# EAGLE design PGTNX08_pitch_out (EAGLE 8.5.2)
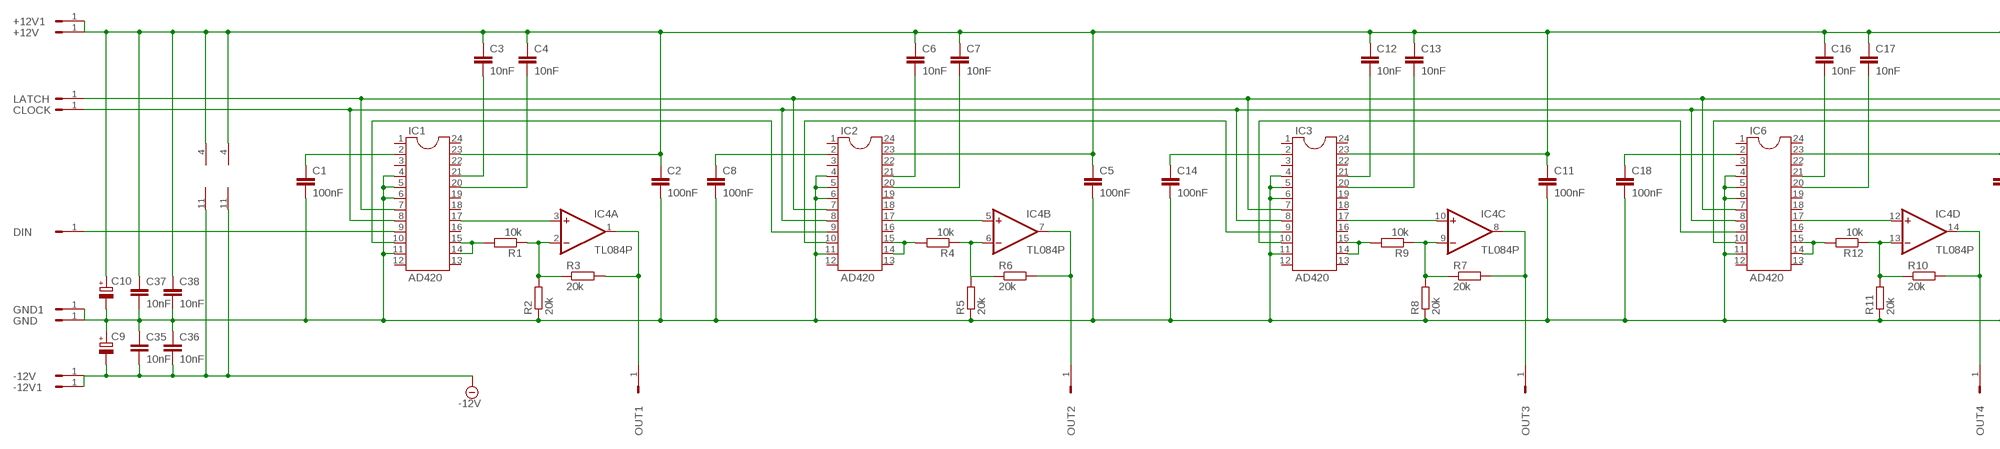
[diagram p0: schematic, sheet 1, part 1 of 2]
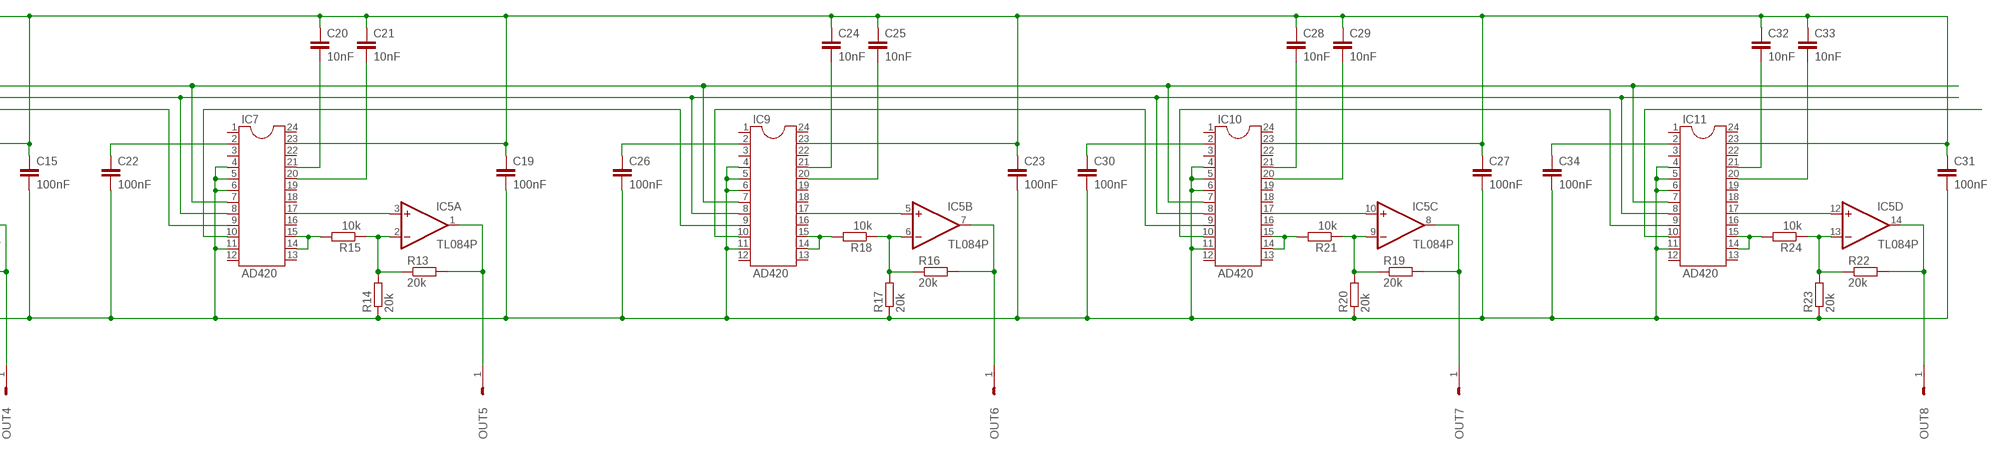
[diagram p1: schematic, sheet 1, part 2 of 2]

## Parts
+12V  HEADER/MALE/01  [HEADER/MALE/01]
+12V1  HEADER/MALE/01  [HEADER/MALE/01]
-12V  HEADER/MALE/01  [HEADER/MALE/01]
-12V1  HEADER/MALE/01  [HEADER/MALE/01]
C1  100nF  CAPACITORCERAMICDISC/5  [CERAMICDISC/5]
C2  100nF  CAPACITORCERAMICDISC/5  [CERAMICDISC/5]
C3  10nF  CAPACITORCERAMICDISC/5  [CERAMICDISC/5]
C4  10nF  CAPACITORCERAMICDISC/5  [CERAMICDISC/5]
C5  100nF  CAPACITORCERAMICDISC/5  [CERAMICDISC/5]
C6  10nF  CAPACITORCERAMICDISC/5  [CERAMICDISC/5]
C7  10nF  CAPACITORCERAMICDISC/5  [CERAMICDISC/5]
C8  100nF  CAPACITORCERAMICDISC/5  [CERAMICDISC/5]
C9  CAPACITOR/POLARIZEDE2.5-6  [E2,5-6]
C10  CAPACITOR/POLARIZEDE2.5-6  [E2,5-6]
C11  100nF  CAPACITORCERAMICDISC/5  [CERAMICDISC/5]
C12  10nF  CAPACITORCERAMICDISC/5  [CERAMICDISC/5]
C13  10nF  CAPACITORCERAMICDISC/5  [CERAMICDISC/5]
C14  100nF  CAPACITORCERAMICDISC/5  [CERAMICDISC/5]
C15  100nF  CAPACITORCERAMICDISC/5  [CERAMICDISC/5]
C16  10nF  CAPACITORCERAMICDISC/5  [CERAMICDISC/5]
C17  10nF  CAPACITORCERAMICDISC/5  [CERAMICDISC/5]
C18  100nF  CAPACITORCERAMICDISC/5  [CERAMICDISC/5]
C19  100nF  CAPACITORCERAMICDISC/5  [CERAMICDISC/5]
C20  10nF  CAPACITORCERAMICDISC/5  [CERAMICDISC/5]
C21  10nF  CAPACITORCERAMICDISC/5  [CERAMICDISC/5]
C22  100nF  CAPACITORCERAMICDISC/5  [CERAMICDISC/5]
C23  100nF  CAPACITORCERAMICDISC/5  [CERAMICDISC/5]
C24  10nF  CAPACITORCERAMICDISC/5  [CERAMICDISC/5]
C25  10nF  CAPACITORCERAMICDISC/5  [CERAMICDISC/5]
C26  100nF  CAPACITORCERAMICDISC/5  [CERAMICDISC/5]
C27  100nF  CAPACITORCERAMICDISC/5  [CERAMICDISC/5]
C28  10nF  CAPACITORCERAMICDISC/5  [CERAMICDISC/5]
C29  10nF  CAPACITORCERAMICDISC/5  [CERAMICDISC/5]
C30  100nF  CAPACITORCERAMICDISC/5  [CERAMICDISC/5]
C31  100nF  CAPACITORCERAMICDISC/5  [CERAMICDISC/5]
C32  10nF  CAPACITORCERAMICDISC/5  [CERAMICDISC/5]
C33  10nF  CAPACITORCERAMICDISC/5  [CERAMICDISC/5]
C34  100nF  CAPACITORCERAMICDISC/5  [CERAMICDISC/5]
C35  10nF  CAPACITORCERAMICDISC/5  [CERAMICDISC/5]
C36  10nF  CAPACITORCERAMICDISC/5  [CERAMICDISC/5]
C37  10nF  CAPACITORCERAMICDISC/5  [CERAMICDISC/5]
C38  10nF  CAPACITORCERAMICDISC/5  [CERAMICDISC/5]
CLOCK  HEADER/MALE/01  [HEADER/MALE/01]
DIN  HEADER/MALE/01  [HEADER/MALE/01]
GND  HEADER/MALE/01  [HEADER/MALE/01]
GND1  HEADER/MALE/01  [HEADER/MALE/01]
IC1  AD420  DIL24-3  [DIL24-3]
IC2  AD420  DIL24-3  [DIL24-3]
IC3  AD420  DIL24-3  [DIL24-3]
IC4  TL084P  [DIL14]
IC5  TL084P  [DIL14]
IC6  AD420  DIL24-3  [DIL24-3]
IC7  AD420  DIL24-3  [DIL24-3]
IC9  AD420  DIL24-3  [DIL24-3]
IC10  AD420  DIL24-3  [DIL24-3]
IC11  AD420  DIL24-3  [DIL24-3]
LATCH  HEADER/MALE/01  [HEADER/MALE/01]
OUT1  HEADER/MALE/01  [HEADER/MALE/01]
OUT2  HEADER/MALE/01  [HEADER/MALE/01]
OUT3  HEADER/MALE/01  [HEADER/MALE/01]
OUT4  HEADER/MALE/01  [HEADER/MALE/01]
OUT5  HEADER/MALE/01  [HEADER/MALE/01]
OUT6  HEADER/MALE/01  [HEADER/MALE/01]
OUT7  HEADER/MALE/01  [HEADER/MALE/01]
OUT8  HEADER/MALE/01  [HEADER/MALE/01]
R1  10k  R-EU_0204/7  [0204/7]
R2  20k  R-EU_0204/7  [0204/7]
R3  20k  RESISTORRESISTOR/UPRIGHT/7.5  [RESISTOR/7.5]
R4  10k  R-EU_0204/7  [0204/7]
R5  20k  R-EU_0204/7  [0204/7]
R6  20k  RESISTORRESISTOR/UPRIGHT/7.5  [RESISTOR/7.5]
R7  20k  RESISTORRESISTOR/UPRIGHT/7.5  [RESISTOR/7.5]
R8  20k  RESISTORRESISTOR/UPRIGHT/7.5  [RESISTOR/7.5]
R9  10k  RESISTORRESISTOR/UPRIGHT/7.5  [RESISTOR/7.5]
R10  20k  RESISTORRESISTOR/UPRIGHT/7.5  [RESISTOR/7.5]
R11  20k  RESISTORRESISTOR/UPRIGHT/7.5  [RESISTOR/7.5]
R12  10k  RESISTORRESISTOR/UPRIGHT/7.5  [RESISTOR/7.5]
R13  20k  RESISTORRESISTOR/UPRIGHT/7.5  [RESISTOR/7.5]
R14  20k  RESISTORRESISTOR/UPRIGHT/7.5  [RESISTOR/7.5]
R15  10k  RESISTORRESISTOR/UPRIGHT/7.5  [RESISTOR/7.5]
R16  20k  RESISTORRESISTOR/UPRIGHT/7.5  [RESISTOR/7.5]
R17  20k  RESISTORRESISTOR/UPRIGHT/7.5  [RESISTOR/7.5]
R18  10k  RESISTORRESISTOR/UPRIGHT/7.5  [RESISTOR/7.5]
R19  20k  RESISTORRESISTOR/UPRIGHT/7.5  [RESISTOR/7.5]
R20  20k  RESISTORRESISTOR/UPRIGHT/7.5  [RESISTOR/7.5]
R21  10k  RESISTORRESISTOR/UPRIGHT/7.5  [RESISTOR/7.5]
R22  20k  RESISTORRESISTOR/UPRIGHT/7.5  [RESISTOR/7.5]
R23  20k  RESISTORRESISTOR/UPRIGHT/7.5  [RESISTOR/7.5]
R24  10k  RESISTORRESISTOR/UPRIGHT/7.5  [RESISTOR/7.5]

## Nets
+12V: +12V1.1 +12V.1 C2.1 C3.1 C4.1 C5.1 C6.1 C7.1 C10.+ C11.1 C12.1 C13.1 C15.1 C16.1 C17.1 C19.1 C20.1 C21.1 C23.1 C24.1 C25.1 C27.1 C28.1 C29.1 C31.1 C32.1 C33.1 C37.1 C38.1 IC1.23 IC2.23 IC3.23 IC4.4(P:V+) IC5.4(P:V+) IC6.23 IC7.23 IC9.23 IC10.23 IC11.23
-12V: -12V1.1 -12V.1 C9.- C35.2 C36.2 IC4.11(P:V-) IC5.11(P:V-)
GND: C1.2 C2.2 C5.2 C8.2 C9.+ C10.- C11.2 C14.2 C15.2 C18.2 C19.2 C22.2 C23.2 C26.2 C27.2 C30.2 C31.2 C34.2 C35.1 C36.1 C37.2 C38.2 GND1.1 GND.1 IC1.4 IC1.5 IC1.6 IC1.11 IC2.4 IC2.5 IC2.6 IC2.11 IC3.4 IC3.5 IC3.6 IC3.11 IC6.4 IC6.5 IC6.6 IC6.11 IC7.4 IC7.5 IC7.6 IC7.11 IC9.4 IC9.5 IC9.6 IC9.11 IC10.4 IC10.5 IC10.6 IC10.11 IC11.4 IC11.5 IC11.6 IC11.11 R2.1 R5.1 R8.1 R11.1 R14.1 R17.1 R20.1 R23.1
N$1: IC3.10 IC6.9
N$2: IC6.10 IC7.9
N$3: DIN.1 IC1.9
N$4: IC2.14 IC2.15 R4.2
N$5: IC2.10 IC3.9
N$6: IC4.2(A:-IN) R1.1 R2.2 R3.1
N$7: IC9.10 IC10.9
N$8: C1.1 IC1.2
N$9: C3.2 IC1.21
N$10: C4.2 IC1.20
N$11: IC1.17 IC4.3(A:+IN)
N$12: IC1.14 IC1.15 R1.2
N$13: IC4.1(A:OUT) OUT1.1 R3.2
N$14: IC7.10 IC9.9
N$15: IC1.10 IC2.9
N$16: IC2.17 IC4.5(B:+IN)
N$17: IC4.7(B:OUT) OUT2.1 R6.2
N$18: IC3.14 IC3.15 R9.2
N$19: C8.1 IC2.2
N$20: C6.2 IC2.21
N$21: C7.2 IC2.20
N$22: IC4.6(B:-IN) R4.1 R5.2 R6.1
N$23: IC3.17 IC4.10(C:+IN)
N$24: IC4.8(C:OUT) OUT3.1 R7.2
N$25: C14.1 IC3.2
N$26: C12.2 IC3.21
N$27: C13.2 IC3.20
N$29: IC10.10 IC11.9
N$30: IC4.9(C:-IN) R7.1 R8.2 R9.1
N$31: IC6.14 IC6.15 R12.2
N$32: IC4.12(D:+IN) IC6.17
N$33: IC4.14(D:OUT) OUT4.1 R10.2
N$34: C18.1 IC6.2
N$35: C16.2 IC6.21
N$36: C17.2 IC6.20
N$37: CLOCK.1 IC1.8 IC2.8 IC3.8 IC6.8 IC7.8 IC9.8 IC10.8 IC11.8
N$38: IC4.13(D:-IN) R10.1 R11.2 R12.1
N$39: IC7.14 IC7.15 R15.2
N$40: IC5.3(A:+IN) IC7.17
N$41: IC5.1(A:OUT) OUT5.1 R13.2
N$42: C22.1 IC7.2
N$43: C20.2 IC7.21
N$44: C21.2 IC7.20
N$46: IC5.2(A:-IN) R13.1 R14.2 R15.1
N$47: IC9.14 IC9.15 R18.2
N$48: IC5.5(B:+IN) IC9.17
N$49: IC5.7(B:OUT) OUT6.1 R16.2
N$50: C26.1 IC9.2
N$51: C24.2 IC9.21
N$52: C25.2 IC9.20
N$53: IC11.10
N$54: IC5.6(B:-IN) R16.1 R17.2 R18.1
N$55: IC10.14 IC10.15 R21.2
N$56: IC5.10(C:+IN) IC10.17
N$57: IC5.8(C:OUT) OUT7.1 R19.2
N$58: C30.1 IC10.2
N$59: C28.2 IC10.21
N$60: C29.2 IC10.20
N$62: IC5.9(C:-IN) R19.1 R20.2 R21.1
N$63: IC11.14 IC11.15 R24.2
N$64: IC5.12(D:+IN) IC11.17
N$65: IC5.14(D:OUT) OUT8.1 R22.2
N$66: C34.1 IC11.2
N$67: C32.2 IC11.21
N$68: C33.2 IC11.20
N$69: IC1.7 IC2.7 IC3.7 IC6.7 IC7.7 IC9.7 IC10.7 IC11.7 LATCH.1
N$70: IC5.13(D:-IN) R22.1 R23.2 R24.1
Unconnected: IC1.1 IC1.3 IC1.12 IC1.13 IC1.16 IC1.18 IC1.19 IC1.22 IC1.24 IC2.1 IC2.3 IC2.12 IC2.13 IC2.16 IC2.18 IC2.19 IC2.22 IC2.24 IC3.1 IC3.3 IC3.12 IC3.13 IC3.16 IC3.18 IC3.19 IC3.22 IC3.24 IC6.1 IC6.3 IC6.12 IC6.13 IC6.16 IC6.18 IC6.19 IC6.22 IC6.24 IC7.1 IC7.3 IC7.12 IC7.13 IC7.16 IC7.18 IC7.19 IC7.22 IC7.24 IC9.1 IC9.3 IC9.12 IC9.13 IC9.16 IC9.18 IC9.19 IC9.22 IC9.24 IC10.1 IC10.3 IC10.12 IC10.13 IC10.16 IC10.18 IC10.19 IC10.22 IC10.24 IC11.1 IC11.3 IC11.12 IC11.13 IC11.16 IC11.18 IC11.19 IC11.22 IC11.24

## Library data of the parts
+12V +12V1 -12V -12V1 CLOCK DIN GND GND1 LATCH OUT1-OUT8 = connectors:HEADER/MALE/01
C1-C8 C11-C38 = capacitors:CAPACITOR: CAPACITOR, European symbol
C9 C10 = capacitors:CAPACITOR/POLARIZED: POLARIZED CAPACITOR, European symbol
IC1-IC3 IC6 IC7 IC9-IC11 = ic-package:DIL24: Dual In Line
IC4 IC5 = ic_analogue:TL084: OP AMP
R1 R2 R4 R5 = rcl:R-EU_: RESISTOR, European symbol
R3 R6-R24 = resistors:RESISTOR: RESISTOR, European symbol

## Board
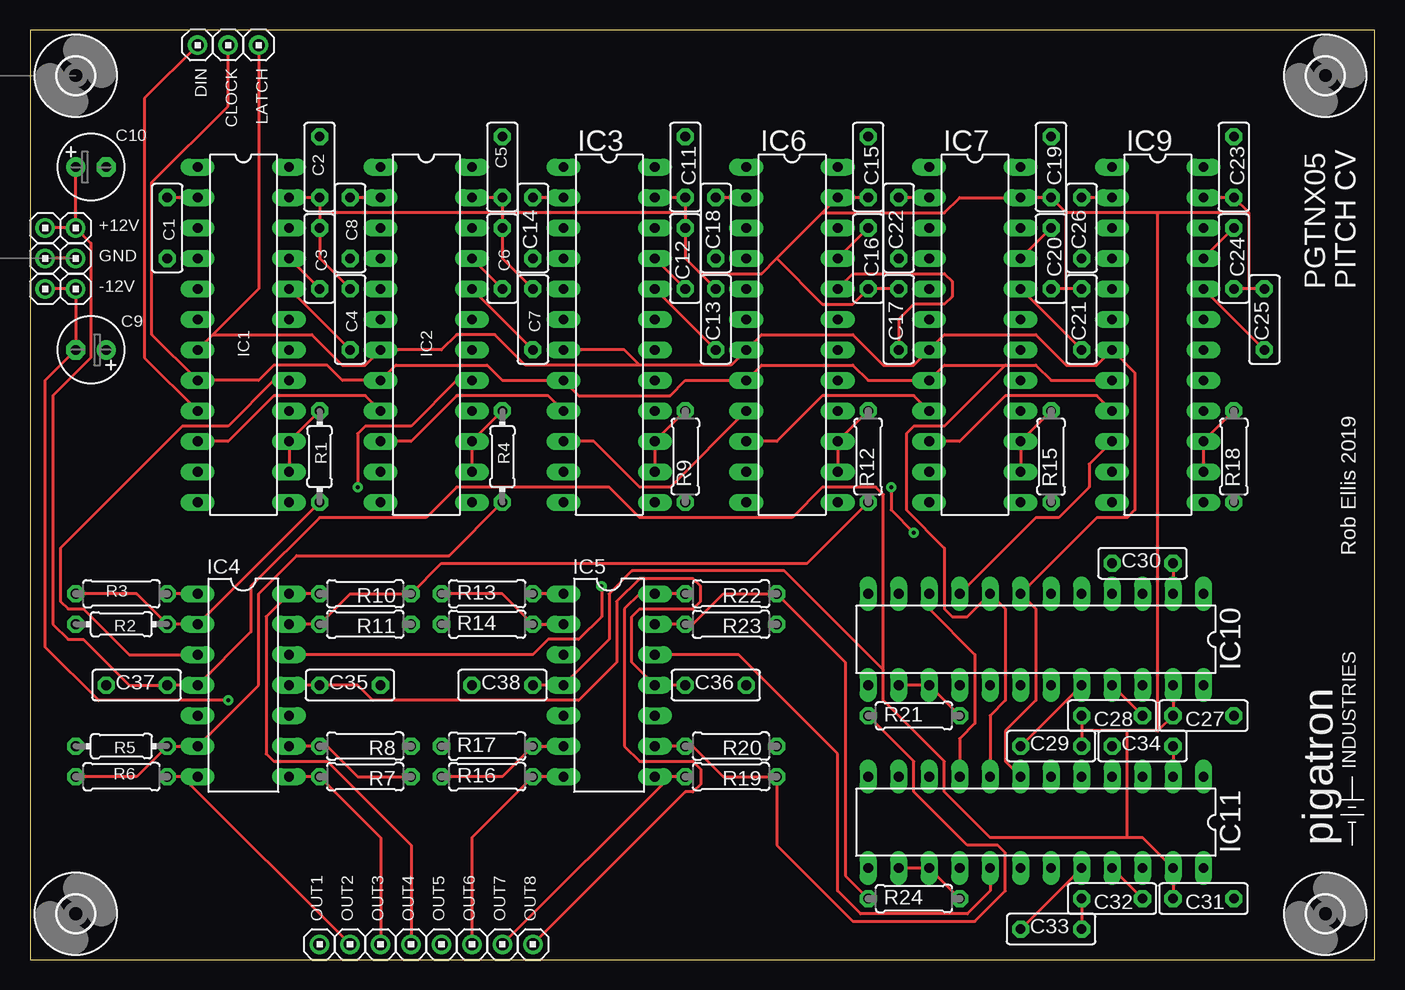
[diagram p2: board, top side]
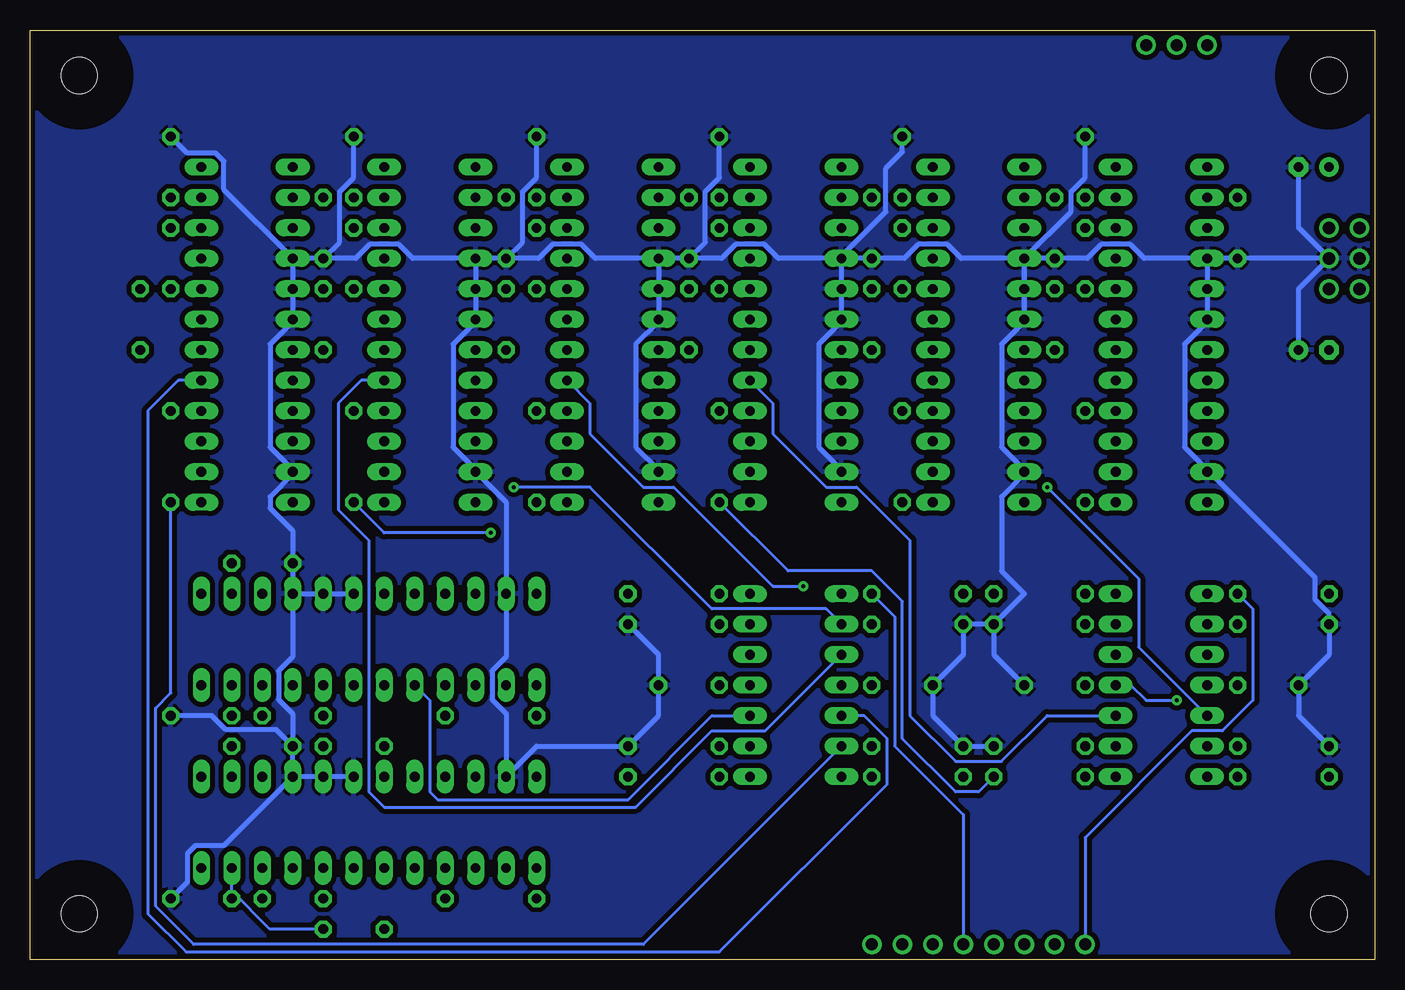
[diagram p3: board, bottom side, seen from below]

Size 112.06 x 77.46 mm. Coordinates in mm from the lower left corner, seen from the top.
Outline: 0,0 112.06,0 112.06,77.46 0,77.46 0,0
Copper layers (1*16): Top 0.0356mm / dielectric 1.5011mm / Bottom 0.0356mm
Design rules "rob": minimum track width 10mil, minimum drill 13mil, track to track 10mil, track to pad 10mil, pad to pad 10mil, via to via 10mil, smd to smd 6mil, copper to edge 15mil, drill to drill 10mil, minimum pad ring 12mil, minimum via ring 10mil, stop-mask expansion 4mil, vias tented up to drill 0mil, thermal gap 10mil

### Footprints (pad centres in the part's own frame; a part is rotated, then mirrored left to right if it is on the bottom)
HEADER/MALE/01 = drill 1.016: 1 0,0
CERAMICDISC/5 = drill 0.813 octagon: 1 -2.54,0; 2 2.54,0
E2,5-6 = drill 0.813 pad 1.6: + -1.27,0 | drill 0.813 pad 1.6 octagon: - 1.27,0
DIL24-3 = drill 0.813 long: 1 -13.97,-3.81; 2 -11.43,-3.81; 3 -8.89,-3.81; 4 -6.35,-3.81; 5 -3.81,-3.81; 6 -1.27,-3.81; 7 1.27,-3.81; 8 3.81,-3.81; 9 6.35,-3.81; 10 8.89,-3.81; 11 11.43,-3.81; 12 13.97,-3.81; 13 13.97,3.81; 14 11.43,3.81; 15 8.89,3.81; 16 6.35,3.81; 17 3.81,3.81; 18 1.27,3.81; 19 -1.27,3.81; 20 -3.81,3.81; 21 -6.35,3.81; 22 -8.89,3.81; 23 -11.43,3.81; 24 -13.97,3.81
DIL14 = drill 0.813 long: 1 -7.62,-3.81; 2 -5.08,-3.81; 3 -2.54,-3.81; 4 0,-3.81; 5 2.54,-3.81; 6 5.08,-3.81; 7 7.62,-3.81; 8 7.62,3.81; 9 5.08,3.81; 10 2.54,3.81; 11 0,3.81; 12 -2.54,3.81; 13 -5.08,3.81; 14 -7.62,3.81
0204/7 = drill 0.813 octagon: 1 -3.81,0; 2 3.81,0
RESISTOR/7.5 = drill 0.813 octagon: 1 -3.81,0; 2 3.81,0
3,0 = hole 3: 0,0

### Placement (x,y rotation side)
+12V  3.81,60.96 0 top
+12V1  1.27,60.96 0 top
-12V  3.81,55.88 0 top
-12V1  1.27,55.88 0 top
C1  11.43,60.96 270 top
C2  24.13,66.04 90 top
C3  24.13,58.42 270 top
C4  26.67,53.34 270 top
C5  39.37,66.04 90 top
C6  39.37,58.42 270 top
C7  41.91,53.34 270 top
C8  26.67,60.96 270 top
C9  5.08,50.8 180 top
C10  5.08,66.04 0 top
C11  54.61,66.04 90 top
C12  54.61,58.42 270 top
C13  57.15,53.34 270 top
C14  41.91,60.96 270 top
C15  69.85,66.04 90 top
C16  69.85,58.42 90 top
C17  72.39,53.34 270 top
C18  57.15,60.96 270 top
C19  85.09,66.04 90 top
C20  85.09,58.42 90 top
C21  87.63,53.34 270 top
C22  72.39,60.96 270 top
C23  100.33,66.04 90 top
C24  100.33,58.42 90 top
C25  102.87,53.34 270 top
C26  87.63,60.96 270 top
C27  97.79,20.32 0 top
C28  90.17,20.32 0 top
C29  85.09,17.78 180 top
C30  92.71,33.02 180 top
C31  97.79,5.08 0 top
C32  90.17,5.08 0 top
C33  85.09,2.54 180 top
C34  92.71,17.78 180 top
C35  26.67,22.86 180 top
C36  57.15,22.86 180 top
C37  8.89,22.86 180 top
C38  39.37,22.86 180 top
CLOCK  16.51,76.2 270 top
DIN  13.97,76.2 270 top
GND  3.81,58.42 0 top
GND1  1.27,58.42 0 top
IC1  17.78,52.07 270 top
IC2  33.02,52.07 270 top
IC3  48.26,52.07 270 top
IC4  17.78,22.86 270 top
IC5  48.26,22.86 270 top
IC6  63.5,52.07 270 top
IC7  78.74,52.07 270 top
IC9  93.98,52.07 270 top
IC10  83.82,26.67 180 top
IC11  83.82,11.43 180 top
LATCH  19.05,76.2 270 top
OUT1  24.13,1.27 90 top
OUT2  26.67,1.27 90 top
OUT3  29.21,1.27 90 top
OUT4  31.75,1.27 90 top
OUT5  34.29,1.27 90 top
OUT6  36.83,1.27 90 top
OUT7  39.37,1.27 90 top
OUT8  41.91,1.27 90 top
R1  24.13,41.91 90 top
R2  7.62,27.94 0 top
R3  7.62,30.48 0 top
R4  39.37,41.91 90 top
R5  7.62,17.78 0 top
R6  7.62,15.24 0 top
R7  27.94,15.24 180 top
R8  27.94,17.78 180 top
R9  54.61,41.91 90 top
R10  27.94,30.48 180 top
R11  27.94,27.94 180 top
R12  69.85,41.91 90 top
R13  38.1,30.48 0 top
R14  38.1,27.94 0 top
R15  85.09,41.91 90 top
R16  38.1,15.24 0 top
R17  38.1,17.78 0 top
R18  100.33,41.91 90 top
R19  58.42,15.24 180 top
R20  58.42,17.78 180 top
R21  73.66,20.32 0 top
R22  58.42,30.48 180 top
R23  58.42,27.94 180 top
R24  73.66,5.08 0 top
U$1  [3,0]  3.81,73.66 0 top
U$2  [3,0]  3.81,3.81 0 top
U$3  [3,0]  107.95,3.81 0 top
U$4  [3,0]  107.95,73.66 0 top
U$5  [PIGATRON-LOGO]  108.58,18.41 90 top

### Tracks (layer width: path | path; a pad name or v marks a point on that pad's centre or on a via)
+12V
  Top 0.254: C21.1 86.36,55.88 | 86.36,55.88 C20.1 | 86.36,62.23 C19.1 IC7.23 77.47,63.5 76.2,62.23 66.04,62.23 | 86.36,55.88 86.36,62.23 | IC9.23 C23.1 101.6,62.23 | C25.1 101.6,55.88 | 101.6,55.88 C24.1 | 101.6,55.88 101.6,62.23 | 101.6,62.23 93.98,62.23 | 93.98,62.23 86.36,62.23 | 24.13,62.23 C2.1 IC1.23 | 24.13,62.23 C3.1 24.13,58.42 C4.1 | 39.37,62.23 C5.1 IC2.23 | 39.37,62.23 C6.1 39.37,58.42 C7.1 | 39.37,62.23 24.13,62.23 | C17.1 C16.1 68.58,54.61 66.04,54.61 62.23,58.42 | C15.1 IC6.23 66.04,62.23 | IC3.23 C11.1 54.61,62.23 | 54.61,62.23 C12.1 54.61,58.42 55.88,57.15 | 55.88,57.15 C13.1 | 62.23,58.42 60.96,57.15 55.88,57.15 | 62.23,58.42 66.04,62.23 | 54.61,62.23 39.37,62.23 | +12V.1 C10.+ | +12V.1 +12V1.1 | +12V.1 5.08,59.69 5.08,50.16 1.91,46.99 1.91,27.94 3.17,26.67 4.45,26.67 8.26,22.86 C37.1 IC4.4 18.41,27.3 18.41,31.11 24.13,36.83 33.02,36.83 35.56,39.37 48.26,39.37 50.8,36.83 63.5,36.83 66.04,39.37 70.48,39.37 71.12,38.73 71.12,24.13 | C28.1 87.63,19.05 | 87.63,19.05 C29.1 | IC10.23 C27.1 93.98,19.05 | 93.98,19.05 91.44,19.05 | 91.44,19.05 87.63,19.05 | C38.1 IC5.4 48.26,26.67 48.26,30.48 50.16,32.38 62.87,32.38 71.12,24.13 | C32.1 C33.1 | 71.12,24.13 71.12,21.59 76.2,16.51 76.2,13.97 80.01,10.16 91.44,10.16 | 91.44,10.16 92.71,10.16 IC11.23 C31.1 | 91.44,10.16 91.44,19.05 | 93.98,19.05 93.98,62.23
  Bottom 0.254: IC11.23 95.25,5.71 92.08,2.54 C33.1
-12V  (via drill 0.33)
  Top 0.254: IC4.11 C35.2 27.3,22.86 28.57,21.59 45.72,21.59 48.9,24.77 48.9,29.84 50.8,31.75 55.24,31.75 55.88,31.11 55.88,29.84 55.24,29.21 50.8,29.21 50.16,28.57 50.16,24.77 IC5.11 C36.2 | -12V1.1 -12V.1 C9.- 1.27,48.26 1.27,26.04 5.71,21.59 v16.51,21.59
  Bottom 0.254: v16.51,21.59 19.05,21.59 20.32,22.86 IC4.11
GND
  Top 0.254: GND.1 GND1.1
  Bottom 0.406: GND.1 C1.2 IC1.4 | IC1.4 IC1.5 IC1.6 13.97,53.16 15.85,51.28 15.85,42.7 13.97,40.82 | C9.+ 6.35,55.88 GND.1 | IC1.4 19.23,58.42 20.39,59.59 22.79,59.59 23.95,58.42 C8.2 IC2.4 | IC2.4 IC2.5 IC2.6 | IC2.6 IC2.4 | IC2.4 25.3,62.33 25.3,63.98 24.13,65.15 C2.2 | IC2.4 34.47,58.42 35.63,59.59 38.02,59.59 39.19,58.42 C14.2 IC3.4 | IC3.4 IC3.5 IC3.6 44.45,53.16 46.33,51.28 46.33,42.7 44.45,40.82 IC3.11 | IC3.4 49.71,58.42 50.88,59.59 53.27,59.59 54.43,58.42 C18.2 | C18.2 IC6.4 | IC6.4 IC6.5 IC6.6 59.69,53.16 61.57,51.28 61.57,42.7 59.69,40.82 IC6.11 | IC6.4 64.95,58.42 66.11,59.59 68.5,59.59 69.67,58.42 C22.2 | C22.2 IC7.4 | IC7.4 IC7.5 IC7.6 74.93,53.16 76.81,51.28 76.81,42.7 74.93,40.82 IC7.11 72.39,38.1 IC10.11 72.39,25.22 73.56,24.05 73.56,21.66 72.39,20.5 IC11.11 69.85,17.78 R20.1 59.69,20.32 C36.1 59.69,25.4 R23.1 | IC7.4 80.19,58.42 81.36,59.59 83.75,59.59 84.91,58.42 C26.2 | C26.2 IC9.4 | IC9.4 IC9.5 IC9.6 90.17,53.16 92.05,51.28 92.05,42.7 90.17,40.82 IC9.11 90.17,40.46 92.05,38.58 92.05,37.62 90.17,35.74 C30.2 IC10.4 | IC3.4 44.45,58.6 40.74,62.3 40.74,65.94 39.37,67.31 C5.2 | C18.2 55.78,59.79 55.78,63.98 54.61,65.15 C11.2 | C22.2 71.02,59.79 71.02,63.98 69.85,65.15 C15.2 | C26.2 86.26,59.79 86.26,63.98 85.09,65.15 C19.2 | C23.2 98.96,67.21 96.59,67.21 95.91,66.52 95.91,64.16 IC9.4 | 13.97,40.82 IC1.11 | IC2.6 29.21,53.16 31.09,51.28 31.09,42.7 29.21,40.82 IC2.11 29.21,40.46 31.09,38.58 31.09,32.36 29.21,30.48 R11.1 | IC10.4 IC10.5 IC10.6 | IC11.6 IC11.5 IC11.4 | IC11.4 C34.2 | C34.2 91.54,19.15 95.73,19.15 96.9,20.32 C27.2 | IC10.4 90.17,25.22 91.34,24.05 91.34,21.66 90.17,20.5 C34.2
  Bottom 0.406: C31.2 98.96,6.45 98.96,8.81 98.27,9.5 95.91,9.5 IC11.4 | R11.1 R14.1 34.29,25.4 C38.2 36.83,20.32 R17.1 R8.1 | R11.1 31.75,25.4 C35.1 | 13.97,40.82 4.98,31.82 4.98,30 3.81,28.83 R2.1 3.81,25.4 C37.2 6.35,20.32 R5.1 | GND.1 6.35,60.96 C10.-
  pour Bottom (isolate 0.406): 0,77.47 0,0 112.39,0 112.39,77.47
N$1
  Top 0.254: IC3.10 46.99,43.18 50.8,39.37 53.34,39.37 IC6.9
N$2
  Top 0.254: IC6.10 62.23,43.18 66.04,46.99 73.66,46.99 IC7.9
N$3
  Top 0.254: IC1.9 9.53,50.16 9.53,71.75 DIN.1
N$4
  Top 0.254: IC2.14 IC2.15 R4.2
N$5
  Top 0.254: IC2.10 31.75,43.18 35.56,46.99 43.18,46.99 IC3.9
N$6
  Top 0.254: R3.1 8.89,30.48 R2.2 IC4.2 R1.1
N$7
  Top 0.254: IC10.9 83.82,36.83 85.72,36.83 88.27,39.37 88.27,41.27 IC9.10
N$8
  Top 0.254: IC1.2 C1.1
N$9
  Top 0.254: C3.2 IC1.21
N$10
  Top 0.254: IC1.20 C4.2
N$11
  Top 0.254: IC4.3 8.26,25.4 4.45,29.21 3.17,29.21 2.54,29.84 2.54,34.29 12.7,44.45 16.51,44.45 20.32,48.26 IC1.17
N$12
  Top 0.254: IC1.14 IC1.15 R1.2
N$13
  Top 0.254: IC4.1 R3.2
  Bottom 0.254: OUT1.1 24.13,10.16 15.24,19.05 12.7,19.05 10.16,21.59 10.16,29.21 R3.2
N$14
  Top 0.254: IC7.10 77.47,43.18 81.28,46.99 88.9,46.99 IC9.9
N$15
  Top 0.254: IC1.10 16.51,43.18 20.32,46.99 27.94,46.99 IC2.9
N$16  (via drill 0.33)
  Top 0.254: v27.3,39.37 27.3,43.81 27.94,44.45 31.75,44.45 35.56,48.26 IC2.17
  Bottom 0.254: IC4.5 19.68,26.04 19.68,31.75 v27.3,39.37
N$17
  Top 0.254: 12.7,15.24 R6.2 | 12.7,15.24 OUT2.1 | 12.7,15.24 IC4.7
N$18
  Top 0.254: IC3.14 IC3.15 R9.2
N$19
  Top 0.254: IC2.2 C8.1
N$20
  Top 0.254: IC2.21 C6.2
N$21
  Top 0.254: IC2.20 C7.2
N$22
  Top 0.254: R6.1 8.89,15.24 R5.2 IC4.6 19.05,22.86 19.05,30.48 22.23,33.66 34.92,33.66 R4.1
N$23
  Bottom 0.254: IC4.10 27.3,20.32 31.11,16.51 34.92,16.51 38.73,20.32 38.73,34.92 43.18,39.37 45.72,39.37 50.16,43.81 50.16,46.35 IC3.17
N$24
  Top 0.254: IC4.8 R7.2 29.21,10.16 OUT3.1
N$25
  Top 0.254: IC3.2 C14.1
N$26
  Top 0.254: IC3.21 C12.2
N$27
  Top 0.254: C13.2 IC3.20
N$29
  Top 0.254: IC11.9 77.47,18.41 78.74,19.68 78.74,25.4 74.93,29.21 IC10.10
N$30
  Top 0.254: IC4.9 R8.2 24.77,17.78 27.3,15.24 R7.1
  Bottom 0.254: R9.1 48.9,32.38 41.91,32.38 39.37,29.84 39.37,18.41 34.92,13.97 33.02,13.97 R7.1
N$31
  Top 0.254: IC6.14 IC6.15 R12.2
N$32  (via drill 0.33)
  Top 0.254: IC4.12 41.91,25.4 43.18,26.67 45.72,26.67 47.62,28.57 v47.62,31.11
  Bottom 0.254: v47.62,31.11 50.16,31.11 58.42,39.37 60.96,39.37 65.41,43.81 65.41,46.35 IC6.17
N$33
  Top 0.254: R10.2 IC4.14 19.68,28.57 19.68,17.14 20.32,16.51 24.77,16.51 31.75,9.53 OUT4.1
N$34
  Top 0.254: IC6.2 C18.1
N$35
  Top 0.254: C16.2 IC6.21
N$36
  Top 0.254: C17.2 72.39,53.34 73.66,54.61 76.2,54.61 76.83,55.24 76.83,56.52 76.2,57.15 68.58,57.15 IC6.20
N$37
  Top 0.254: IC11.8 80.01,20.32 81.28,21.59 81.28,29.21 IC10.8 78.11,28.57 76.83,28.57 76.2,29.21 76.2,34.29 73.03,37.47 73.03,43.81 73.66,44.45 76.2,44.45 81.28,49.53 | IC9.8 85.09,48.26 83.82,49.53 81.28,49.53 | 81.28,49.53 76.2,49.53 IC7.8 69.85,48.26 68.58,49.53 60.96,49.53 IC6.8 54.61,48.26 53.34,46.99 45.72,46.99 IC3.8 39.37,48.26 38.1,49.53 30.48,49.53 IC2.8 26.04,48.26 24.77,49.53 20.32,49.53 19.05,48.26 IC1.8 10.16,52.07 10.16,64.77 16.51,71.12 CLOCK.1
N$38
  Top 0.254: IC4.13 R11.2 26.67,30.48 R10.1 34.29,33.02 64.77,33.02 R12.1
N$39
  Top 0.254: IC7.14 IC7.15 R15.2
N$40
  Bottom 0.254: IC5.3 50.8,19.05 55.24,19.05 61.59,12.7 82.55,12.7 83.82,13.97 83.82,34.92 86.36,37.47 86.36,46.35 84.45,48.26 IC7.17
N$41
  Top 0.254: IC5.1 R13.2
  Bottom 0.254: OUT5.1 34.29,12.06 40.01,17.78 40.01,28.57 R13.2
N$42
  Top 0.254: IC7.2 C22.1
N$43
  Top 0.254: C20.2 IC7.21
N$44
  Top 0.254: IC7.20 C21.2
N$46  (via drill 0.33)
  Top 0.254: R13.1 39.37,30.48 R14.2 IC5.2 | v73.66,35.56 71.75,37.47 v71.75,39.37
  Bottom 0.254: R15.1 82.55,35.56 v73.66,35.56 | v71.75,39.37 65.41,39.37 55.24,29.21 45.72,29.21 IC5.2
N$47
  Top 0.254: IC9.14 IC9.15 R18.2
N$48
  Bottom 0.254: IC5.5 42.55,20.32 40.64,18.41 40.64,14.61 54.61,0.64 99.06,0.64 102.23,3.81 102.23,45.72 99.69,48.26 IC9.17
N$49
  Top 0.254: IC5.7 R16.2 36.83,10.16 OUT6.1
N$50
  Top 0.254: IC9.2 C26.1
N$51
  Top 0.254: C24.2 IC9.21
N$52
  Top 0.254: IC9.20 C25.2
N$54
  Top 0.254: R16.1 39.37,15.24 R17.2 IC5.6
  Bottom 0.254: R18.1 100.33,22.23 101.6,20.95 101.6,4.45 98.42,1.27 60.96,1.27 IC5.6
N$55
  Top 0.254: IC10.14 IC10.15 R21.2
N$56
  Bottom 0.254: IC5.10 55.24,20.32 62.23,13.34 78.11,13.34 78.74,13.97 78.74,21.59 IC10.17
N$57
  Top 0.254: R19.2 53.34,15.24 | 53.34,15.24 OUT7.1 | 53.34,15.24 IC5.8
N$58
  Top 0.254: C30.1 IC10.2
N$59
  Top 0.254: IC10.21 C28.2
N$60
  Top 0.254: IC10.20 C29.2
N$62
  Top 0.254: IC5.9 R20.2 55.24,17.78 57.78,15.24 R19.1 62.23,9.53 68.58,3.17 78.74,3.17 81.28,5.71 81.28,8.89 80.64,9.53 78.11,9.53 73.66,13.97 73.66,16.51 R21.1
N$63
  Top 0.254: IC11.14 IC11.15 R24.2
N$64
  Top 0.254: IC5.12 59.05,25.4 67.31,17.14 67.31,5.71 69.22,3.81 78.11,3.81 80.01,5.71 IC11.17
N$65
  Top 0.254: R22.2 IC5.14 50.8,30.48 49.53,29.21 49.53,17.78 50.8,16.51 55.24,16.51 55.88,15.88 55.88,14.61 55.24,13.97 54.61,13.97 OUT8.1
N$66
  Top 0.254: C34.1 IC11.2
N$67
  Top 0.254: IC11.21 C32.2
N$68
  Top 0.254: IC11.20 C33.2
N$69
  Top 0.254: 15.24,52.07 19.05,55.88 LATCH.1 | 15.24,52.07 IC1.7 | 15.24,52.07 23.5,52.07 26.04,49.53 27.94,49.53 IC2.7 34.29,50.8 35.56,52.07 38.73,52.07 41.27,49.53 50.8,49.53 | IC11.7 81.28,16.51 81.28,19.05 83.82,21.59 83.82,29.21 IC10.7 88.9,36.83 91.44,36.83 92.08,37.47 92.08,48.9 IC9.7 88.9,49.53 86.36,49.53 83.82,52.07 76.2,52.07 IC7.7 73.66,49.53 71.12,49.53 68.58,52.07 60.96,52.07 IC6.7 58.42,49.53 50.8,49.53 | IC3.7 49.53,50.8 50.8,49.53
N$70
  Top 0.254: IC5.13 R23.2 55.24,27.94 57.78,30.48 R22.1 67.94,24.77 67.94,6.99 R24.1

### Text on the board
tNames: PGTNX05 | PITCH CV | Rob Ellis 2019